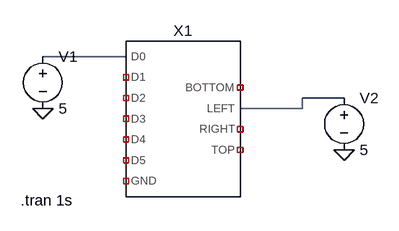
[diagram p0: schematic Draft5.asc]
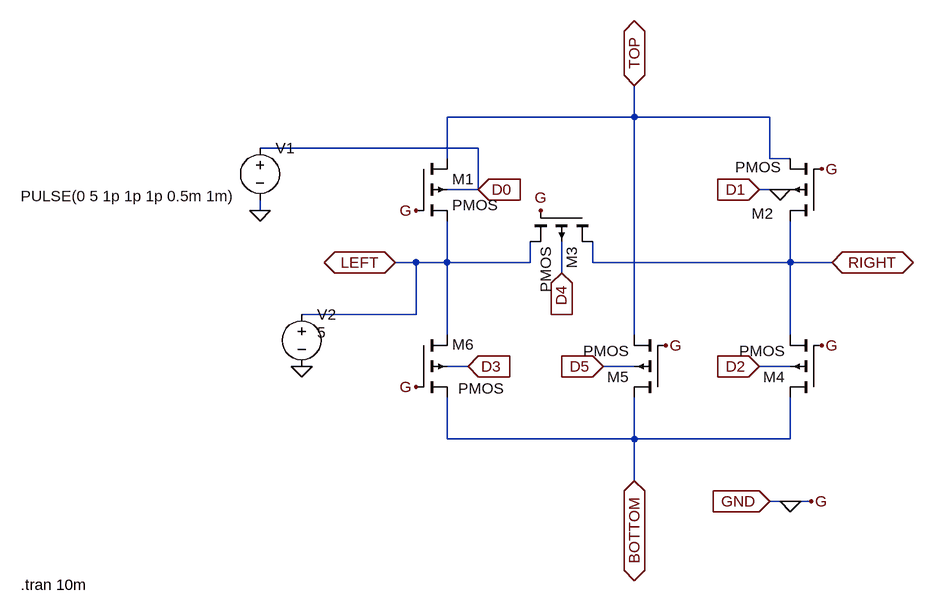
[diagram p1: sub-circuit switch.asc]
Draft5.asc, the LTspice schematic file:
Version 4
SHEET 1 880 680
WIRE 176 112 48 112
WIRE 512 176 448 176
WIRE 448 192 448 176
WIRE 448 192 352 192
FLAG 48 192 0
FLAG 512 256 0
SYMBOL voltage 48 96 R0
SYMATTR InstName V1
SYMATTR Value 5
SYMBOL voltage 512 160 R0
SYMATTR InstName V2
SYMATTR Value 5
SYMBOL SWITCH 256 208 R0
SYMATTR InstName X1
TEXT 14 334 Left 2 !.tran 1s

switch.asc, the sub-circuit schematic file:
Version 4
SHEET 1 888 720
WIRE 384 -48 384 -96
WIRE 384 -48 96 -48
WIRE 592 -48 384 -48
WIRE 144 0 -192 0
WIRE 96 16 96 -48
WIRE 592 16 592 -48
WIRE 624 16 592 16
WIRE 144 64 144 0
WIRE 144 64 96 64
WIRE 608 64 576 64
WIRE 624 64 608 64
WIRE -192 96 -192 80
WIRE 48 176 16 176
WIRE 96 176 96 112
WIRE 96 176 48 176
WIRE 224 176 224 144
WIRE 224 176 96 176
WIRE 320 176 320 144
WIRE 624 176 624 112
WIRE 624 176 320 176
WIRE 688 176 624 176
WIRE 272 192 272 144
WIRE 48 256 48 176
WIRE 48 256 -128 256
WIRE 96 288 96 176
WIRE 384 288 384 -48
WIRE 624 288 624 176
WIRE 128 336 96 336
WIRE 384 336 336 336
WIRE 624 336 576 336
WIRE 96 448 96 384
WIRE 384 448 384 384
WIRE 384 448 96 448
WIRE 624 448 624 384
WIRE 624 448 384 448
WIRE 384 512 384 448
WIRE 624 544 592 544
WIRE 656 544 624 544
FLAG 144 64 D0
IOPIN 144 64 In
FLAG 576 64 D1
IOPIN 576 64 In
FLAG 576 336 D2
IOPIN 576 336 In
FLAG 128 336 D3
IOPIN 128 336 In
FLAG 272 192 D4
IOPIN 272 192 In
FLAG 336 336 D5
IOPIN 336 336 In
FLAG 384 -96 TOP
IOPIN 384 -96 BiDir
FLAG 384 512 BOTTOM
IOPIN 384 512 BiDir
FLAG 16 176 LEFT
IOPIN 16 176 BiDir
FLAG 688 176 RIGHT
IOPIN 688 176 BiDir
FLAG 48 368 G
FLAG 48 96 G
FLAG 240 96 G
FLAG 672 32 G
FLAG 672 304 G
FLAG 432 304 G
FLAG 592 544 GND
IOPIN 592 544 In
FLAG 656 544 G
FLAG -192 96 0
FLAG 624 544 0
FLAG -128 336 0
FLAG 608 64 0
SYMBOL pmos4 48 16 R0
SYMATTR InstName M1
SYMBOL pmos4 672 112 R180
WINDOW 0 74 11 Left 2
WINDOW 3 62 83 Left 2
SYMATTR InstName M2
SYMBOL pmos4 672 384 R180
SYMATTR InstName M4
SYMBOL pmos4 432 384 R180
SYMATTR InstName M5
SYMBOL pmos4 48 288 R0
WINDOW 0 56 14 Left 2
WINDOW 3 65 82 Left 2
SYMATTR InstName M6
SYMBOL pmos4 320 96 R90
SYMATTR InstName M3
SYMBOL voltage -192 -16 R0
WINDOW 3 -368 90 Left 2
WINDOW 123 0 0 Left 0
WINDOW 39 0 0 Left 0
SYMATTR Value PULSE(0 5 1p 1p 1p 0.5m 1m)
SYMATTR InstName V1
SYMBOL voltage -128 240 R0
WINDOW 3 24 44 Left 2
WINDOW 123 0 0 Left 0
WINDOW 39 0 0 Left 0
SYMATTR Value 5
SYMATTR InstName V2
TEXT -560 672 Left 2 !.tran 10m

The netlist it stands for:
* Draft5.asc
V1 N001 0 5
V2 N002 0 5
XX1 N001 NC_01 NC_02 NC_03 NC_04 NC_05 NC_06 NC_07 N002 NC_08 NC_09 switch

* block symbol definitions
.subckt switch D0 D1 D2 D3 D4 D5 GND BOTTOM LEFT RIGHT TOP
M1 TOP 0 LEFT D0 PMOS
M2 RIGHT 0 TOP 0 PMOS
M4 BOTTOM 0 RIGHT D2 PMOS
M5 BOTTOM 0 TOP D5 PMOS
M6 LEFT 0 BOTTOM D3 PMOS
M3 RIGHT 0 LEFT D4 PMOS
V1 D0 0 PULSE(0 5 1p 1p 1p 0.5m 1m)
V2 LEFT 0 5
.tran 10m
.ends switch

.model NMOS NMOS
.model PMOS PMOS
.lib standard.mos
.tran 1s
.backanno
.end